# EAGLE schematic ade_7753 (EAGLE 6.3)
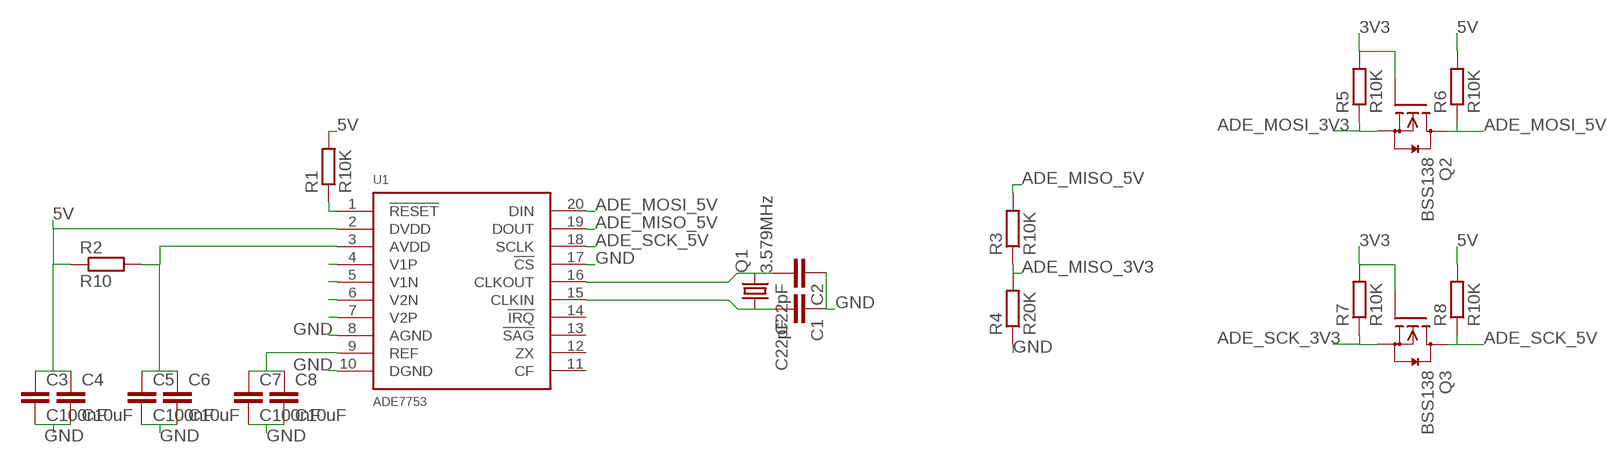
[diagram p0: schematic, sheet 1]

## Parts
C1  C22pF  C-EUC0805  [C0805]
C2  C22pF  C-EUC0805  [C0805]
C3  C100nF  C-EUC0805  [C0805]
C4  C10uF  C-EUC0805  [C0805]
C5  C100nF  C-EUC0805  [C0805]
C6  C10uF  C-EUC0805  [C0805]
C7  C100nF  C-EUC0805  [C0805]
C8  C10uF  C-EUC0805  [C0805]
Q1  3.579MHz  CRYSTALHC49S  [HC49/S]
Q2  BSS138  [SOT23]
Q3  BSS138  [SOT23]
R1  R10K  R-EU_M0805  [M0805]
R2  R10  R-EU_M0805  [M0805]
R3  R10K  R-EU_M0805  [M0805]
R4  R20K  R-EU_M0805  [M0805]
R5  R10K  R-EU_M0805  [M0805]
R6  R10K  R-EU_M0805  [M0805]
R7  R10K  R-EU_M0805  [M0805]
R8  R10K  R-EU_M0805  [M0805]
U1  ADE7753  [SSOP-20]

## Nets
3V3: Q2.1(G) Q3.1(G) R5.2 R7.2
5V: C3.1 C4.1 R1.2 R2.1 R6.2 R8.2 U1.2(DVDD)
ADE_MISO_3V3: R3.1 R4.2
ADE_MISO_5V: R3.2 U1.19(DOUT)
ADE_MOSI_3V3: Q2.2(S) R5.1
ADE_MOSI_5V: Q2.3(D) R6.1 U1.20(DIN)
ADE_SCK_3V3: Q3.2(S) R7.1
ADE_SCK_5V: Q3.3(D) R8.1 U1.18(SCLK)
GND: C1.1 C2.1 C3.2 C4.2 C5.2 C6.2 C7.2 C8.2 R4.1 U1.8(AGND) U1.10(DGND) U1.17(!CS)
N$1: C1.2 Q1.1 U1.15(CLKIN)
N$2: C2.2 Q1.2 U1.16(CLKOUT)
N$3: R1.1 U1.1(!RESET)
N$4: C5.1 C6.1 R2.2 U1.3(AVDD)
N$5: C7.1 C8.1 U1.9(REF)
N$6: U1.4(V1P)
N$7: U1.5(V1N)
N$8: U1.6(V2N)
N$9: U1.7(V2P)
Unconnected: U1.11(CF) U1.12(ZX) U1.13(!SAG) U1.14(!IRQ)

## Library data of the parts
C1-C8 = resistor:C-EU: CAPACITOR, European symbol
Q1 = crystal:CRYSTAL: CRYSTAL; OC_FARNELL: 1667008; OC_NEWARK: unknown
Q2 Q3 = m-pad-2.1:BSS138: Fairchild Semiconductors BSS138 N-Channel Logic Level Enhancement Mode Field Effect Transistor General Description: These N-Channel enhancement mode field effect transistors are produced using Fairchild's proprietary, high cell density, DMOS technology. These products have been designed to minimize on-state resistance while provide rugged, reliable, and fast switching performance.These products are particularly suited for low voltage, low current applications such as small servo motor control, power MOSFET gate drivers, and other switching applications. Features: 0.22 A, 50 V. RDS(ON) = 3.5Ohm @ VGS = 10 V RDS(ON) = 6.0Ohm @ VGS = 4.5 V High density cell design for extremely low RDS(ON) Rugged and Reliable Compact industry standard SOT-23 surface mount package Please send any comments to: messi@users.sourceforge.net
R1-R8 = resistor:R-EU_: RESISTOR, European symbol
U1 = powercube:ADE7753: Single-Phase Multifunction Metering IC; DIGIKEY: ADE7753ARSZRLCT-ND; MOUSER: 584-ADE7753ARSZR; NEWARK: 59K0984